# EAGLE design ModuloMaster (EAGLE 7.5.0)
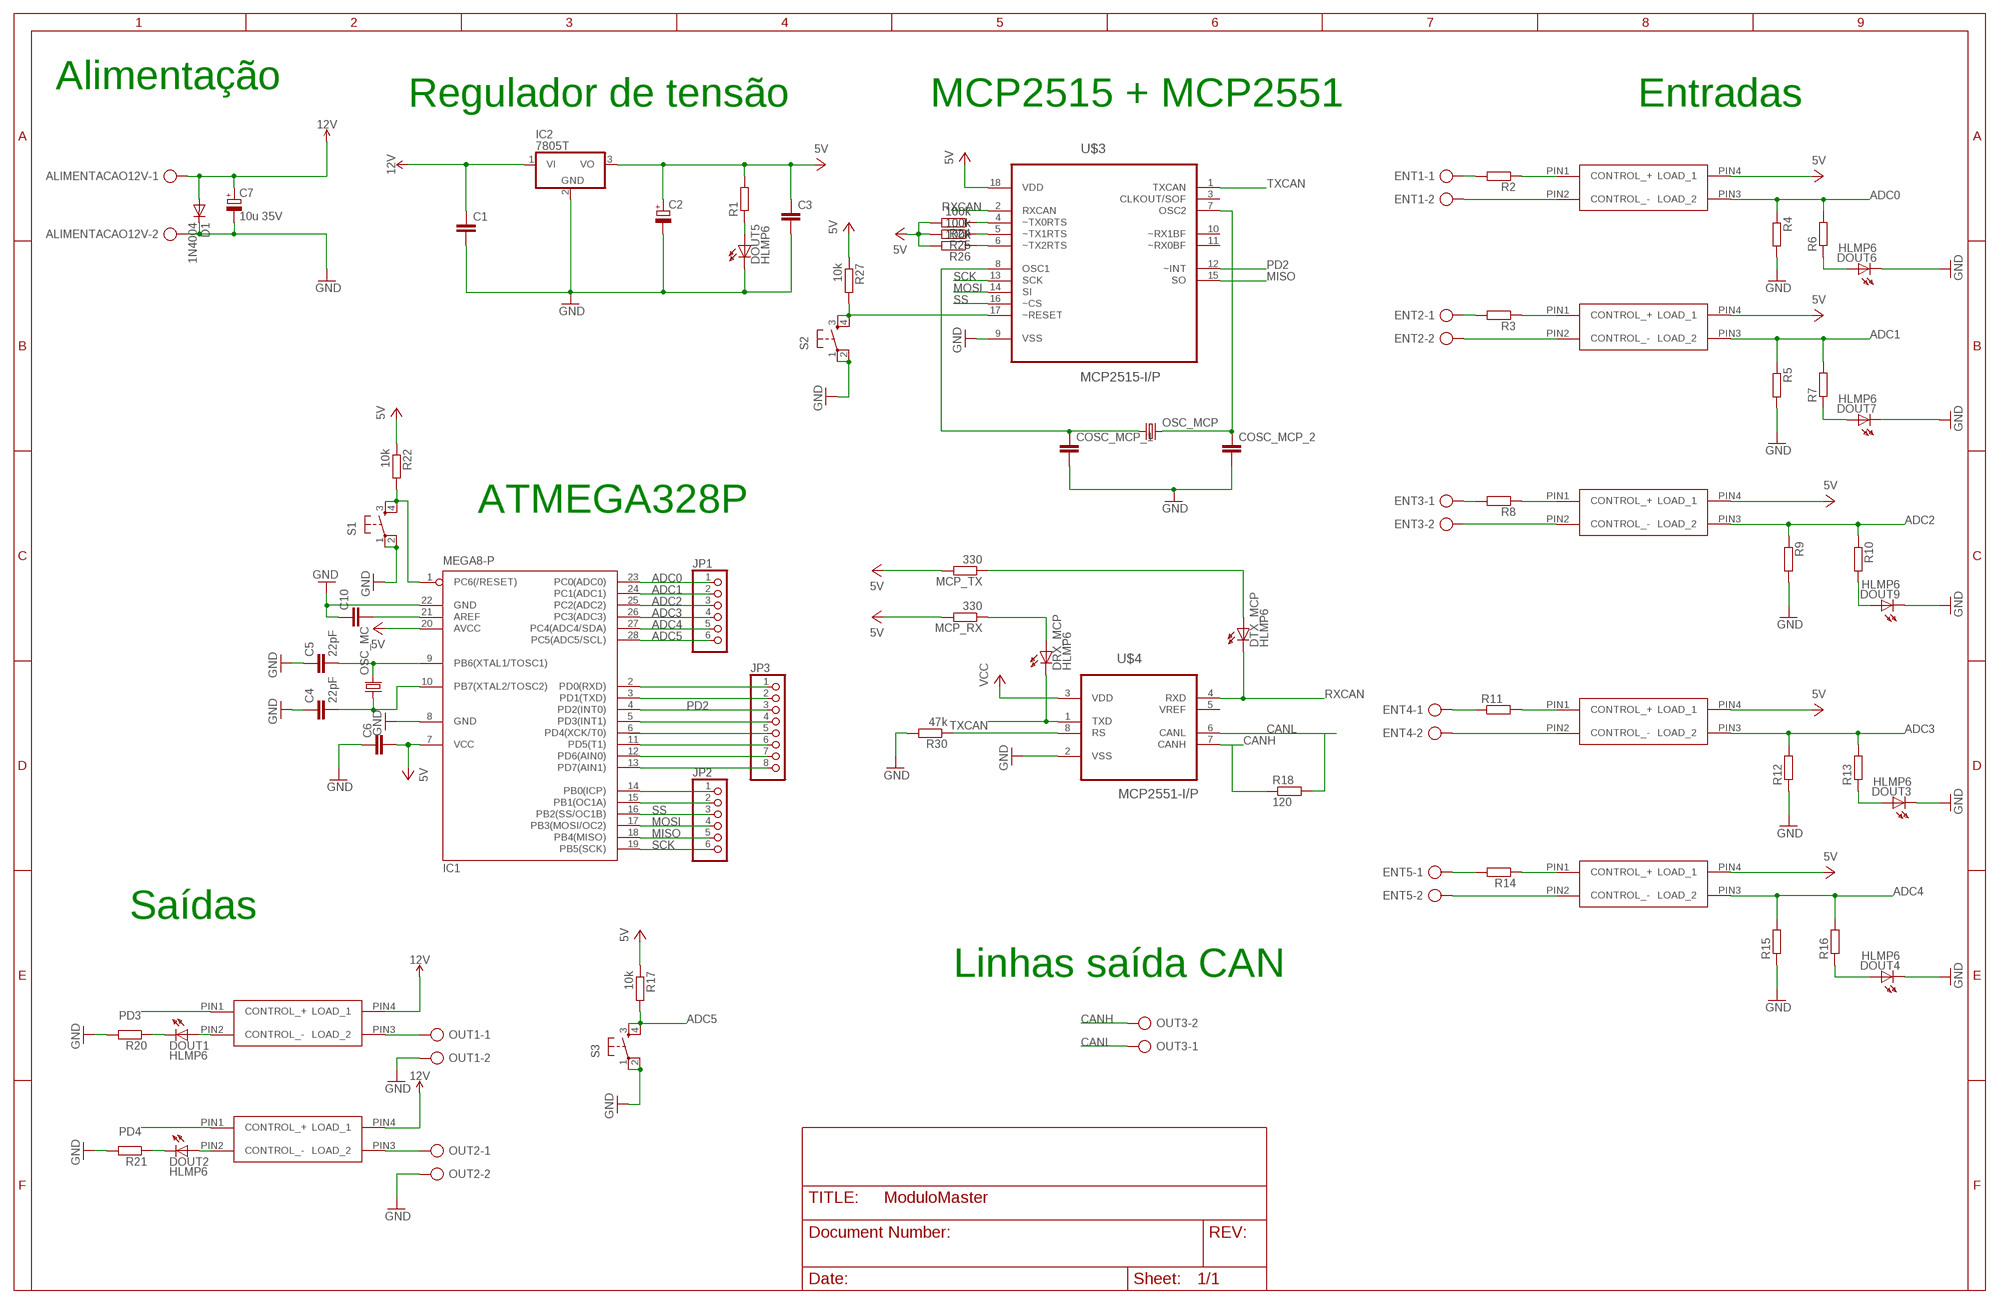
[diagram p0: schematic, sheet 1]

## Parts
ALIMENTACAO12V  AK300/2  [AK300/2]
C1  C-EU025-025X050  [C025-025X050]
C2  CPOL-EUSANYO_C6  [SANYO-OSCON_C6]
C3  C-EU025-025X050  [C025-025X050]
C4  22pF  CAP_  [AXIAL-5MM]
C5  22pF  CAP_  [AXIAL-5MM]
C6  CAP_  [AXIAL-5MM]
C7  10u 35V  CPOL-EUSANYO_C6  [SANYO-OSCON_C6]
C10  CAP_  [AXIAL-5MM]
COSC_MCP_1  CAP_  [AXIAL-5MM]
COSC_MCP_2  CAP_  [AXIAL-5MM]
D1  1N4004  [DO41-10]
DOUT1  HLMP6  [HLMP6]
DOUT2  HLMP6  [HLMP6]
DOUT3  HLMP6  [HLMP6]
DOUT4  HLMP6  [HLMP6]
DOUT5  HLMP6  [HLMP6]
DOUT6  HLMP6  [HLMP6]
DOUT7  HLMP6  [HLMP6]
DOUT9  HLMP6  [HLMP6]
DRX_MCP  HLMP6  [HLMP6]
DTX_MCP  HLMP6  [HLMP6]
ENT1  AK300/2  [AK300/2]
ENT2  AK300/2  [AK300/2]
ENT3  AK300/2  [AK300/2]
ENT4  AK300/2  [AK300/2]
ENT5  AK300/2  [AK300/2]
IC1  MEGA8-P  [DIL28-3]
IC2  7805T  [TO220H]
JP1  PINHD-1X6  [1X06]
JP2  PINHD-1X6  [1X06]
JP3  PINHD-1X8  [1X08]
MCP_RX  330  R-EU_0204/7  [0204/7]
MCP_TX  330  R-EU_0204/7  [0204/7]
OSC_MC  CRYSTALHC49S  [HC49/S]
OSC_MCP  CRYSTALHC49S  [HC49/S]
OUT1  AK300/2  [AK300/2]
OUT2  AK300/2  [AK300/2]
OUT3  AK300/2  [AK300/2]
R1  R-EU_0204/7  [0204/7]
R2  R-EU_0204/7  [0204/7]
R3  R-EU_0204/7  [0204/7]
R4  R-EU_0204/7  [0204/7]
R5  R-EU_0204/7  [0204/7]
R6  R-EU_0204/7  [0204/7]
R7  R-EU_0204/7  [0204/7]
R8  R-EU_0204/7  [0204/7]
R9  R-EU_0204/7  [0204/7]
R10  R-EU_0204/7  [0204/7]
R11  R-EU_0204/7  [0204/7]
R12  R-EU_0204/7  [0204/7]
R13  R-EU_0204/7  [0204/7]
R14  R-EU_0204/7  [0204/7]
R15  R-EU_0204/7  [0204/7]
R16  R-EU_0204/7  [0204/7]
R17  10k  R-EU_0204/7  [0204/7]
R18  120  R-EU_0204/7  [0204/7]
R20  R-EU_0204/7  [0204/7]
R21  R-EU_0204/7  [0204/7]
R22  10k  R-EU_0204/7  [0204/7]
R24  100k  R-EU_0204/7  [0204/7]
R25  100k  R-EU_0204/7  [0204/7]
R26  100k  R-EU_0204/7  [0204/7]
R27  10k  R-EU_0204/7  [0204/7]
R30  47k  R-EU_0204/7  [0204/7]
S1  TAC_SWITCHPTH  [TACTILE-PTH]
S2  TAC_SWITCHPTH  [TACTILE-PTH]
S3  TAC_SWITCHPTH  [TACTILE-PTH]
U$1  OPTO-RELAY-CPC1017N  [SOP-4]
U$2  OPTO-RELAY-CPC1017N  [SOP-4]
U$3  MCP2515-I/P  [DIP254P762X432-18]
U$4  MCP2551-I/P  [DIP254P762X432-8]
U$5  OPTO-RELAY-CPC1017N  [SOP-4]
U$6  OPTO-RELAY-CPC1017N  [SOP-4]
U$7  OPTO-RELAY-CPC1017N  [SOP-4]
U$8  OPTO-RELAY-CPC1017N  [SOP-4]
U$9  OPTO-RELAY-CPC1017N  [SOP-4]

## Nets
5V: C2.+ C3.1 IC2.3(VO) R1.2
ADC0: IC1.23(PC0(ADC0)) JP1.1 R4.1 R6.2 U$5.PIN3(LOAD_2)
ADC1: IC1.24(PC1(ADC1)) JP1.2 R5.1 R7.2 U$6.PIN3(LOAD_2)
ADC2: IC1.25(PC2(ADC2)) JP1.3 R9.1 R10.1 U$7.PIN3(LOAD_2)
ADC3: IC1.26(PC3(ADC3)) JP1.4 R12.2 R13.2 U$8.PIN3(LOAD_2)
ADC4: IC1.27(PC4(ADC4/SDA)) JP1.5 R15.2 R16.2 U$9.PIN3(LOAD_2)
ADC5: IC1.28(PC5(ADC5/SCL)) JP1.6 R17.2 S3.3 S3.4
CANH: OUT3.2 R18.1 U$4.7(CANH)
CANL: OUT3.1 R18.2 U$4.6(CANL)
GND: ALIMENTACAO12V.2 C1.2 C2.- C3.2 C4.P$1 C5.P$1 C6.P$1 C7.- C10.P$1 COSC_MCP_1.P$2 COSC_MCP_2.P$2 D1.C DOUT3.K DOUT4.K DOUT5.K DOUT6.K DOUT7.K DOUT9.K IC1.8(GND) IC1.22(GND) IC2.2(GND) OUT1.2 OUT2.2 R4.2 R5.2 R9.2 R12.1 R15.1 R20.2 R21.2 R30.2 S1.1 S1.2 S2.1 S2.2 S3.1 S3.2 U$3.9(VSS) U$4.2(VSS)
MISO: IC1.18(PB4(MISO)) JP2.5 U$3.15(SO)
MOSI: IC1.17(PB3(MOSI/OC2)) JP2.4 U$3.14(SI)
N$1: DOUT2.A U$2.PIN2(CONTROL_-)
N$2: DOUT1.A U$1.PIN2(CONTROL_-)
N$3: C4.P$2 IC1.10(PB7(XTAL2/TOSC2)) OSC_MC.1
N$4: C5.P$2 IC1.9(PB6(XTAL1/TOSC1)) OSC_MC.2
N$5: ENT4.1 R11.1
N$6: DRX_MCP.A MCP_RX.1
N$7: DTX_MCP.A MCP_TX.1
N$8: R11.2 U$8.PIN1(CONTROL_+)
N$9: C10.P$2 IC1.21(AREF)
N$10: ENT1.1 R2.2
N$11: R2.1 U$5.PIN1(CONTROL_+)
N$12: ENT4.2 U$8.PIN2(CONTROL_-)
N$13: COSC_MCP_1.P$1 OSC_MCP.1 U$3.8(OSC1)
N$14: COSC_MCP_2.P$1 OSC_MCP.2 U$3.7(OSC2)
N$15: ENT5.1 R14.2
N$16: R14.1 U$9.PIN1(CONTROL_+)
N$17: ENT5.2 U$9.PIN2(CONTROL_-)
N$20: ENT1.2 U$5.PIN2(CONTROL_-)
N$21: ENT2.1 R3.2
N$22: OUT1.1 U$1.PIN3(LOAD_2)
N$23: IC1.1(PC6(/RESET)) R22.2 S1.3 S1.4
N$25: DOUT1.K R20.1
N$26: OUT2.1 U$2.PIN3(LOAD_2)
N$27: DOUT2.K R21.1
N$28: R30.1 U$4.8(RS)
N$29: R25.1 U$3.5(~TX1RTS)
N$30: R24.1 U$3.4(~TX0RTS)
N$31: R26.1 U$3.6(~TX2RTS)
N$32: ENT2.2 U$6.PIN2(CONTROL_-)
N$33: R3.1 U$6.PIN1(CONTROL_+)
N$34: DOUT5.A R1.1
N$35: DOUT6.A R6.1
N$36: DOUT7.A R7.1
N$37: R27.2 S2.3 S2.4 U$3.17(~RESET)
N$39: DOUT3.A R13.1
N$40: ENT3.1 R8.2
N$41: R8.1 U$7.PIN1(CONTROL_+)
N$42: ENT3.2 U$7.PIN2(CONTROL_-)
N$45: DOUT9.A R10.2
N$48: DOUT4.A R16.1
N$56: IC1.14(PB0(ICP)) JP2.1
N$57: IC1.15(PB1(OC1A)) JP2.2
N$62: IC1.2(PD0(RXD)) JP3.1
N$63: IC1.3(PD1(TXD)) JP3.2
N$64: IC1.13(PD7(AIN1)) JP3.8
N$65: IC1.12(PD6(AIN0)) JP3.7
N$66: IC1.11(PD5(T1)) JP3.6
PD2: IC1.4(PD2(INT0)) JP3.3 U$3.12(~INT)
PD3: IC1.5(PD3(INT1)) JP3.4 U$1.PIN1(CONTROL_+)
PD4: IC1.6(PD4(XCK/T0)) JP3.5 U$2.PIN1(CONTROL_+)
RXCAN: DTX_MCP.K U$3.2(RXCAN) U$4.4(RXD)
SCK: IC1.19(PB5(SCK)) JP2.6 U$3.13(SCK)
SS: IC1.16(PB2(SS/OC1B)) JP2.3 U$3.16(~CS)
TXCAN: DRX_MCP.K U$3.1(TXCAN) U$4.1(TXD)
VCC: C6.P$2 IC1.7(VCC) IC1.20(AVCC) MCP_RX.2 MCP_TX.2 R17.1 R22.1 R24.2 R25.2 R26.2 R27.1 U$3.18(VDD) U$4.3(VDD) U$5.PIN4(LOAD_1) U$6.PIN4(LOAD_1) U$7.PIN4(LOAD_1) U$8.PIN4(LOAD_1) U$9.PIN4(LOAD_1) ; supply symbol labelled 5V
VDD: ALIMENTACAO12V.1 C1.1 C7.+ D1.A IC2.1(VI) U$1.PIN4(LOAD_1) U$2.PIN4(LOAD_1) ; supply symbol labelled 12V
Unconnected: U$3.3(CLKOUT/SOF) U$3.10(~RX1BF) U$3.11(~RX0BF) U$4.5(VREF)

## Notes on the sheet
- Alimentação
- Regulador de tensão | MCP2515 + MCP2551 | Entradas
- ATMEGA328P
- Saídas
- Linhas saída CAN

## Library data of the parts
ALIMENTACAO12V ENT1-ENT5 OUT1-OUT3 = con-ptr500:AK300/2: CONNECTOR; OC_FARNELL: unknown; OC_NEWARK: unknown
C1 C3 = rcl:C-EU: CAPACITOR, European symbol
C2 C7 = rcl:CPOL-EU: POLARIZED CAPACITOR, European symbol
C4-C6 C10 COSC_MCP_1 COSC_MCP_2 = SparkFun-Passives:CAP: Capacitor Standard 0603 ceramic capacitor, and 0.1" leaded capacitor.
D1 = diode:1N4004: DIODE general purpose rectifier, 1 A
DOUT1-DOUT7 DOUT9 DRX_MCP DTX_MCP = display-hp:HLMP6: LED 2mm horizontal; MF: AGILENT TECHNOLOGIES; MPN: HLMP-6500; OC_FARNELL: 1652490; OC_NEWARK: 40K0088
IC1 = atmel:MEGA8-P: MICROCONTROLLER 8 Kbytes FLASH, 1 kbytes SRAM, 512 bytes EEPROM, USART, 4-channel 10 bit ADC, 2-channel 8 bit ADC Pin compatible with Atmega48, ATMega88, ATMega168 Source: avr.lbr; OC_FARNELL: unknown; OC_NEWARK: unknown
IC2 = linear:78*: Positive VOLTAGE REGULATOR Source: http://cache.national.com/ds/LM/LM78L05.pdf http://www.fairchildsemi.com/ds/LM/LM7805.pdf
JP1 JP2 = pinhead:PINHD-1X6: PIN HEADER
JP3 = pinhead:PINHD-1X8: PIN HEADER
MCP_RX MCP_TX R1-R18 R20-R22 R24-R27 R30 = resistor:R-EU_: RESISTOR, European symbol
OSC_MC OSC_MCP = crystal:CRYSTAL: CRYSTAL; OC_FARNELL: 1667008; OC_NEWARK: unknown
S1-S3 = SparkFun-Retired:TAC_SWITCH: Momentary Switch Button commonly used for reset or general input. Spark Fun Electronics SKU : COM-00097 SMT- SWCH-08247
U$1 U$2 U$5-U$9 = Feesta-parts:OPTO-RELAY-CPC1017N
U$3 = Microchip_By_element14_Batch_1:MCP2515-I/P: Stand-Alone CAN Controller; DESCRIPTION: CAN CONTRL; MPN: MCP2515-I/P; OC_FARNELL: 1439391; OC_NEWARK: 61K2945; PACKAGE: PDIP-18; SUPPLIER: MICROCHIP
U$4 = Microchip_By_element14_Batch_1:MCP2551-I/P: High-Speed CAN Transceiver; DESCRIPTION: CAN CTRL; MPN: MCP2551-I/P; OC_FARNELL: 1292240; OC_NEWARK: 61K2947; PACKAGE: PDIP-8; SUPPLIER: Microchip

## Board
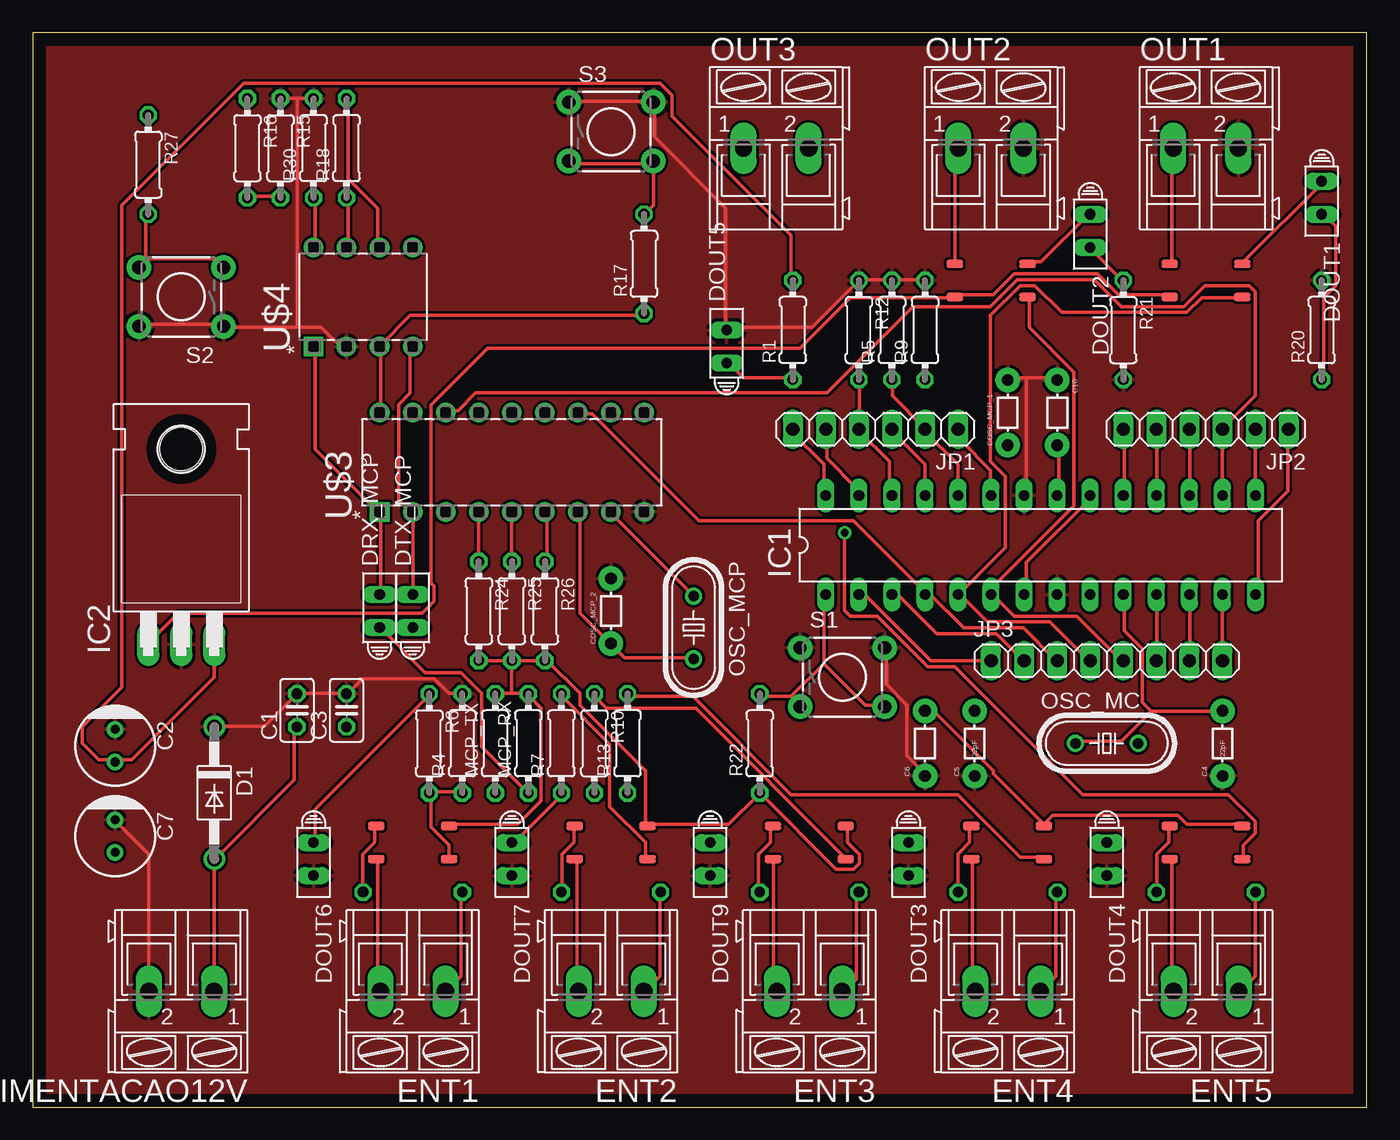
[diagram p1: board, top side]
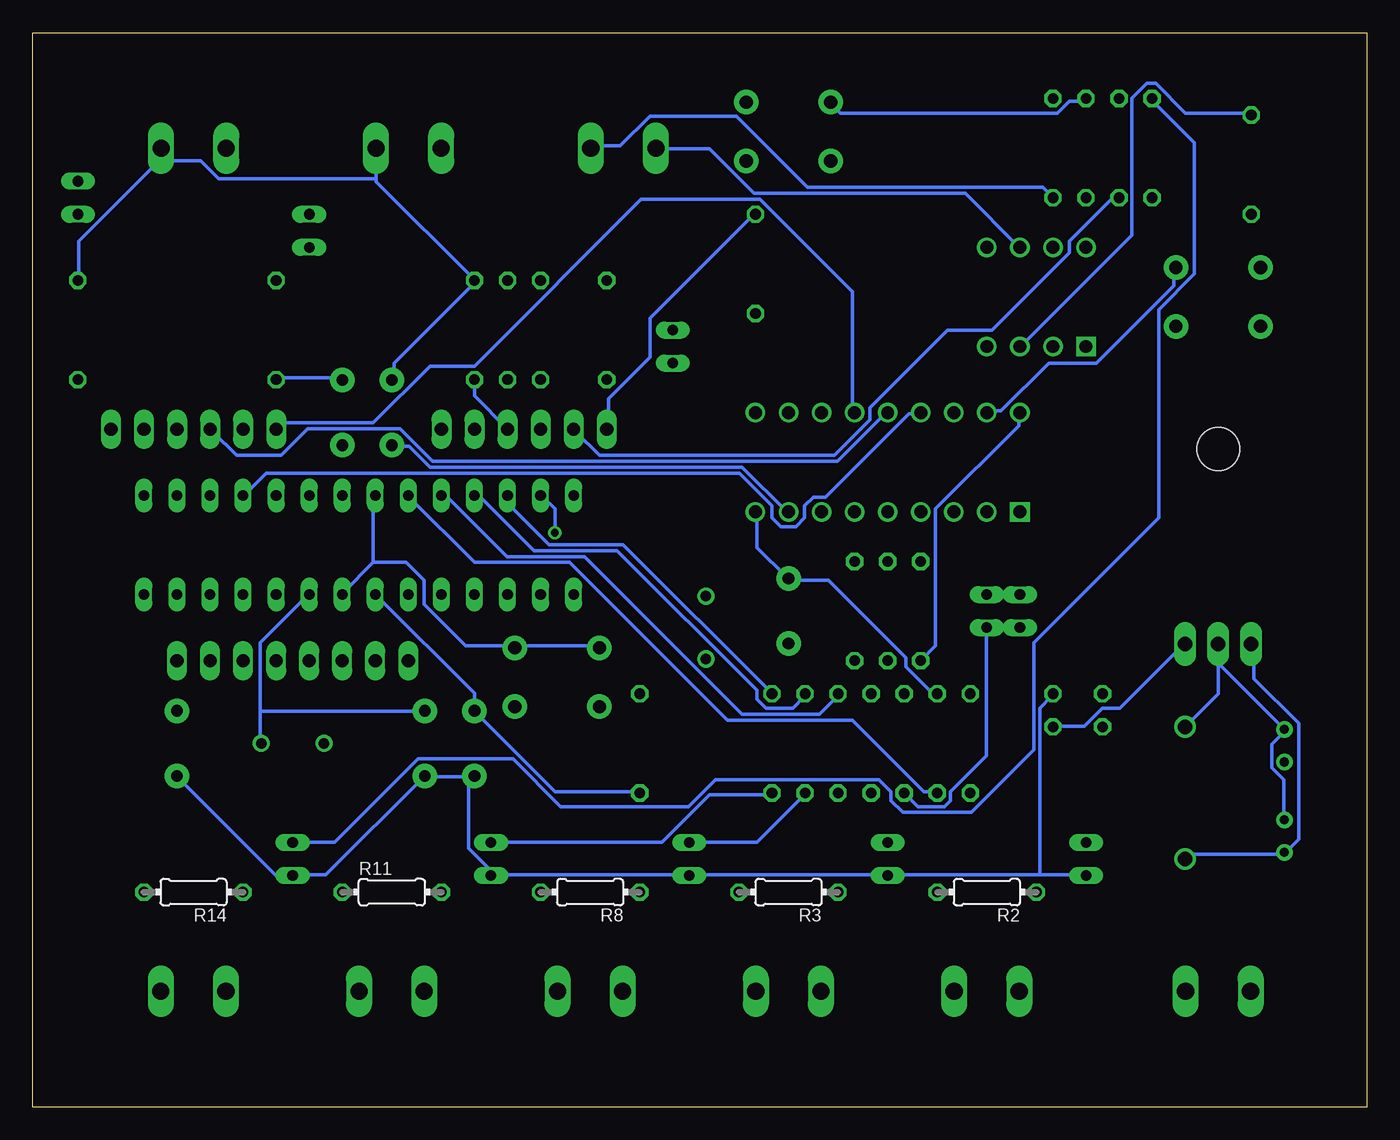
[diagram p2: board, bottom side, seen from below]

Size 102.54 x 82.54 mm. Coordinates in mm from the lower left corner, seen from the top.
Outline: 0,0 102.54,0 102.54,82.54 0,82.54 0,0
Copper layers (1*16): Top 0.035mm / dielectric 1.5mm / Bottom 0.035mm
Design rules "default": minimum track width 10mil, minimum drill 24mil, track to track 8mil, track to pad 8mil, pad to pad 8mil, via to via 8mil, smd to smd 8mil, copper to edge 40mil, drill to drill 8mil, minimum pad ring 10mil, minimum via ring 8mil, stop-mask expansion 4mil, vias tented up to drill 0mil, thermal gap 10mil

### Footprints (pad centres in the part's own frame; a part is rotated, then mirrored left to right if it is on the bottom)
AK300/2 = drill 1.321 long: 1 -2.515,0; 2 2.489,0
C025-025X050 = drill 0.813 octagon: 1 -1.27,0; 2 1.27,0
SANYO-OSCON_C6 = drill 0.7 pad 1.27: + 1.25,0; - -1.25,0
AXIAL-5MM = drill 0.9 pad 1.88: P$1 -2.5,0; P$2 2.5,0
DO41-10 = drill 1.118: A 5.08,0; C -5.08,0
HLMP6 = drill 0.813 long: A -1.27,0; K 1.27,0
DIL28-3 = drill 0.813 long: 1 -16.51,-3.81; 2 -13.97,-3.81; 3 -11.43,-3.81; 4 -8.89,-3.81; 5 -6.35,-3.81; 6 -3.81,-3.81; 7 -1.27,-3.81; 8 1.27,-3.81; 9 3.81,-3.81; 10 6.35,-3.81; 11 8.89,-3.81; 12 11.43,-3.81; 13 13.97,-3.81; 14 16.51,-3.81; 15 16.51,3.81; 16 13.97,3.81; 17 11.43,3.81; 18 8.89,3.81; 19 6.35,3.81; 20 3.81,3.81; 21 1.27,3.81; 22 -1.27,3.81; 23 -3.81,3.81; 24 -6.35,3.81; 25 -8.89,3.81; 26 -11.43,3.81; 27 -13.97,3.81; 28 -16.51,3.81
TO220H = drill 1.118 long: 1 -2.54,-10.16; 2 0,-10.16; 3 2.54,-10.16 | hole 3.302: 0,4.826
1X06 = drill 1.016 long: 1 -6.35,0; 2 -3.81,0; 3 -1.27,0; 4 1.27,0; 5 3.81,0; 6 6.35,0
1X08 = drill 1.016 long: 1 -8.89,0; 2 -6.35,0; 3 -3.81,0; 4 -1.27,0; 5 1.27,0; 6 3.81,0; 7 6.35,0; 8 8.89,0
0204/7 = drill 0.813 octagon: 1 -3.81,0; 2 3.81,0
HC49/S = drill 0.813: 1 -2.413,0; 2 2.413,0
TACTILE-PTH = drill 1.016 pad 1.88: 1 -3.251,2.261; 2 3.251,2.261; 3 -3.251,-2.261; 4 3.251,-2.261
SOP-4 = smd 0.635 x 1.27: PIN1 -1.27,-2.794; PIN2 1.27,-2.794; PIN3 1.27,2.794; PIN4 -1.27,2.794
DIP254P762X432-18 = drill 0.991 square: 1 -7.62,20.32 | drill 0.991: 2 -7.62,17.78; 3 -7.62,15.24; 4 -7.62,12.7; 5 -7.62,10.16; 6 -7.62,7.62; 7 -7.62,5.08; 8 -7.62,2.54; 9 -7.62,0; 10 0,0; 11 0,2.54; 12 0,5.08; 13 0,7.62; 14 0,10.16; 15 0,12.7; 16 0,15.24; 17 0,17.78; 18 0,20.32
DIP254P762X432-8 = drill 0.991 square: 1 -7.62,7.62 | drill 0.991: 2 -7.62,5.08; 3 -7.62,2.54; 4 -7.62,0; 5 0,0; 6 0,2.54; 7 0,5.08; 8 0,7.62

### Placement (x,y rotation side)
ALIMENTACAO12V  11.43,8.89 180 top
C1  20.32,30.48 90 top
C2  6.35,27.76 270 top
C3  24.13,30.48 90 top
C4  91.44,27.94 90 top
C5  72.39,27.94 90 top
C6  68.58,27.94 90 top
C7  6.35,20.81 270 top
C10  78.74,53.34 270 top
COSC_MCP_1  74.93,53.34 90 top
COSC_MCP_2  44.45,38.1 90 top
D1  13.97,24.13 270 top
DOUT1  99.06,69.85 270 top
DOUT2  81.28,67.31 270 top
DOUT3  67.31,19.05 270 top
DOUT4  82.55,19.05 270 top
DOUT5  53.34,58.42 90 top
DOUT6  21.59,19.05 270 top
DOUT7  36.83,19.05 270 top
DOUT9  52.07,19.05 270 top
DRX_MCP  26.67,38.1 90 top
DTX_MCP  29.21,38.1 90 top
ENT1  29.21,8.89 180 top
ENT2  44.45,8.89 180 top
ENT3  59.69,8.89 180 top
ENT4  74.93,8.89 180 top
ENT5  90.17,8.89 180 top
IC1  77.47,43.18 0 top
IC2  11.43,45.72 0 top
JP1  64.77,52.07 180 top
JP2  90.17,52.07 180 top
JP3  82.55,34.29 0 top
MCP_RX  38.1,27.94 90 top
MCP_TX  35.56,27.94 90 top
OSC_MC  82.55,27.94 0 top
OSC_MCP  50.8,36.83 270 top
OUT1  90.17,73.66 0 top
OUT2  73.66,73.66 0 top
OUT3  57.15,73.66 0 top
R1  58.42,59.69 90 top
R2  29.21,16.51 180 bottom
R3  44.45,16.51 180 bottom
R4  33.02,27.94 90 top
R5  66.04,59.69 90 top
R6  30.48,27.94 270 top
R7  40.64,27.94 90 top
R8  59.69,16.51 180 bottom
R9  68.58,59.69 90 top
R10  43.18,27.94 270 top
R11  74.93,16.51 0 bottom
R12  63.5,59.69 270 top
R13  45.72,27.94 90 top
R14  90.17,16.51 180 bottom
R15  19.05,73.66 270 top
R16  16.51,73.66 270 top
R17  46.99,64.77 90 top
R18  24.13,73.66 90 top
R20  99.06,59.69 90 top
R21  83.82,59.69 270 top
R22  55.88,27.94 90 top
R24  34.29,38.1 270 top
R25  36.83,38.1 270 top
R26  39.37,38.1 270 top
R27  8.89,72.39 270 top
R30  21.59,73.66 90 top
S1  62.23,33.02 0 top
S2  11.43,62.23 180 top
S3  44.45,74.93 0 top
U$1  90.17,63.5 90 top
U$2  73.66,63.5 90 top
U$3  46.99,53.34 90 top
U$4  29.21,66.04 90 top
U$5  29.21,20.32 270 top
U$6  44.45,20.32 270 top
U$7  59.69,20.32 270 top
U$8  74.93,20.32 270 top
U$9  90.17,20.32 270 top

### Tracks (layer width: path | path; a pad name or v marks a point on that pad's centre or on a via)
5V
  Top 0.254: 6.4,26.52 C2.+ | 14.17,35.43 IC2.3 13.97,33.02 7.62,26.67 6.51,26.67 C2.+ | R1.2 58.29,63.55 58.29,66.98 49.15,76.12 49.15,77.72 48.23,78.64 16.23,78.64 6.86,69.27 6.86,32.26 3.81,29.21 3.81,27.94 5.08,26.67 6.19,26.67 C2.+
  Bottom 0.254: C3.1 24,29.26 21.72,29.26 20.34,30.63 18.97,30.63 14.17,35.43 IC2.3
ADC0
  Top 0.254: U$5.PIN3 32,20.12 30.63,21.49 30.63,24 R6.2 30.63,24.23 32.92,24.23 R4.1 | IC1.23 73.61,47.09 73.61,48.92 71.32,51.21 71.32,51.89 JP1.1
  Bottom 0.254: R4.1 33.15,24.23 34.06,24.23 39.55,29.72 49.15,29.72 61.27,41.83 68.58,41.83 73.61,46.86 IC1.23
ADC1
  Top 0.254: IC1.24 71.09,47.09 71.09,49.38 68.58,51.89 JP1.2 68.58,52.12 66.06,54.63 66.06,55.78 R5.1 | U$6.PIN3 47.09,19.2 47.09,20.34 44.35,23.09 44.35,27.89 40.69,31.55 R7.2
  Bottom 0.254: IC1.24 71.09,46.86 70.64,46.86 66.06,42.29 60.12,42.29 48.01,30.18 42.06,30.18 40.69,31.55 R7.2
ADC2
  Top 0.254: IC1.25 68.58,49.38 66.06,51.89 JP1.3 | U$7.PIN3 62.41,19.2 50.98,30.63 44.12,30.63 43.2,31.55 R10.1
  Bottom 0.254: R9.1 68.58,54.63 66.06,52.12 JP1.3 | IC1.25 68.58,46.86 68.12,46.86 64.01,42.75 57.61,42.75 46.86,32 46.86,31.32 46.18,30.63 44.12,30.63 43.2,31.55 R10.1
ADC3
  Top 0.254: IC1.26 65.84,47.09 65.84,49.61 63.55,51.89 JP1.4 63.55,52.12 63.55,55.78 R12.2 | U$8.PIN3 77.72,19.2 75.89,19.2 71.09,24 58.29,24 50.75,31.55 45.72,31.55 R13.2
  Bottom 0.254: IC1.26 65.84,46.86 65.84,46.18 62.87,43.2 57.15,43.2 45.72,31.77 R13.2
ADC4  (via drill 0.61)
  Top 0.254: R16.2 16.69,69.95 18.97,69.95 R15.2 | v62.41,44.12 62.41,38.18 62.87,37.72 64.92,37.72 68.81,33.83 70.87,33.83 80.7,24 91.9,24 93.95,21.95 93.95,21.03 93.04,20.12 93.04,19.2 U$9.PIN3 | JP1.5 61.04,51.89 61.04,49.84 63.32,47.55 63.32,47.09 IC1.27
  Bottom 0.254: v62.41,44.12 62.41,45.95 63.32,46.86 IC1.27 | R15.2 19.2,69.72 19.66,69.72 22.86,66.52 22.86,65.61 28.8,59.66 32.23,59.66 38.18,53.72 38.18,52.81 40.92,50.06 58.98,50.06 60.81,51.89 JP1.5
ADC5
  Top 0.254: IC1.28 60.81,47.09 60.81,49.38 58.29,51.89 JP1.6 | 47.09,68.58 R17.2 47.7,69.29 S3.4 47.5,72.47 41.38,72.47 S3.3
  Bottom 0.254: JP1.6 58.29,52.12 58.29,54.41 55.09,57.61 55.09,60.58 47.09,68.58 R17.2
CANH
  Top 0.254: R18.1 24.23,69.72 24.23,66.06 U$4.7
  Bottom 0.254: R18.1 24.92,70.64 42.98,70.64 48.46,76.12 55.09,76.12 57.38,73.84 59.44,73.84 OUT3.2
CANL
  Top 0.254: R18.2 24.23,77.27 24.23,71.32 26.52,69.04 26.52,66.06 U$4.6
  Bottom 0.254: OUT3.1 54.63,73.61 50.52,73.61 47.09,70.18 30.86,70.18 26.75,66.06 U$4.6
GND
  Top 0.254: S1.2 65.61,35.2 65.61,32.46 67.21,30.86 67.21,26.98 68.58,25.6 C6.P$1 | ALIMENTACAO12V.2 8.91,8.91 8.91,19.43 6.4,21.95 C7.- | R4.2 32.92,31.77 32,31.77 30.86,32.92 25.38,32.92 24.23,31.77 C3.2 24,31.77 20.34,31.77 C1.2 17.83,29.26 14.17,29.26 D1.C | 20.34,77.5 21.49,77.5 R30.2 | 20.34,77.5 19.2,77.5 R15.1 | 20.34,59.89 14.86,59.89 S2.1 14.63,60.12 8.23,60.12 S2.2 | 20.34,59.89 22.17,59.89 23.55,58.52 24,58.52 U$4.2 | 20.34,59.89 20.34,77.5 | 76.35,56.01 78.64,56.01 C10.P$1 | 76.35,56.01 74.98,56.01 COSC_MCP_1.P$2 | 76.35,56.01 76.35,47.09 IC1.22 | S3.1 41.38,77.27 47.55,77.27 S3.2 47.78,77.04 47.78,74.52 53.26,69.04 53.26,59.89 DOUT5.K 53.49,59.89 59.89,59.89 R12.1 63.55,63.55 65.84,63.55 R5.2 66.06,63.55 68.58,63.55 R9.2
  Bottom 0.254: C4.P$1 91.44,25.38 83.9,17.83 82.75,17.83 DOUT4.K 82.53,17.83 80.01,17.83 72.47,25.38 C5.P$1 72.24,25.38 69.49,25.38 69.04,24.92 | S1.1 58.98,35.43 65.38,35.43 S1.2 65.61,35.43 69.27,35.43 72.47,38.63 72.47,40.46 73.84,41.83 76.35,41.83 | 69.04,24.92 69.04,19.89 67.44,18.29 67.44,17.83 DOUT3.K 67.21,17.83 52.12,17.83 DOUT9.K 51.89,17.83 37.03,17.83 DOUT7.K 36.8,17.83 25.15,17.83 | 69.04,24.92 68.58,25.38 C6.P$1 69.04,24.92 | 25.15,17.83 21.72,17.83 DOUT6.K | C7.- 6.4,22.17 6.4,25.15 7.32,26.06 7.32,27.89 6.4,28.8 C2.- 11.43,34.09 | U$3.9 46.86,45.72 46.86,42.98 44.58,40.69 COSC_MCP_2.P$2 44.35,40.46 41.38,40.46 35.43,34.52 35.43,33.83 33.15,31.55 R4.2 | 13.95,29.26 D1.C 11.43,31.75 11.43,34.09 | 25.15,17.83 25.15,30.63 24.23,31.55 C3.2 | 76.35,41.83 76.35,46.86 IC1.22 | 76.35,41.83 78.64,39.55 IC1.8 | R21.2 83.67,56.01 78.87,56.01 C10.P$1 | 92.81,72.69 98.98,66.52 98.98,63.55 R20.2 | 92.81,72.69 92.81,73.61 OUT1.2 92.81,72.69 | 76.12,71.32 76.12,71.09 68.58,63.55 R9.2 68.58,63.32 74.75,57.15 74.75,56.01 COSC_MCP_1.P$2 | 76.12,71.32 76.12,73.61 OUT2.2 | 92.81,72.69 89.61,72.69 88.24,71.32 76.12,71.32 | R30.2 21.72,77.27 22.86,77.27 23.77,76.35 40.46,76.35 41.15,77.04 S3.1 | IC2.2 11.43,34.09
  pour Top: -1.27,86.36 107.95,86.36 107.95,-5.08 -8.89,-5.08 -8.89,86.36
MISO
  Top 0.254: IC1.18 86.41,47.09 86.41,51.89 JP2.5
  Bottom 0.254: U$3.15 34.29,53.26 35.2,53.26 41.6,46.86 42.52,46.86 43.2,46.18 43.2,45.26 43.89,44.58 45.03,44.58 45.72,45.26 45.72,46.18 48.23,48.69 84.58,48.69 86.18,47.09 IC1.18
MOSI
  Top 0.254: IC1.17 88.92,47.09 88.92,51.89 JP2.4
  Bottom 0.254: U$3.14 37.03,53.26 40.69,49.61 71.78,49.61 74.3,52.12 81.38,52.12 83.44,50.06 86.87,50.06 88.7,51.89 JP2.4
N$1
  Top 0.254: U$2.PIN2 76.58,64.92 77.5,64.92 81.15,68.58 DOUT2.A
N$2
  Top 0.254: U$1.PIN2 93.04,64.92 99.21,71.09 DOUT1.A
N$3
  Top 0.254: 85.95,30.4 83.67,28.12 80.24,28.12 OSC_MC.1 | 85.95,30.4 91.44,30.4 C4.P$2 | 85.95,30.4 85.27,31.09 85.27,35.2 83.9,36.58 83.9,39.32 IC1.10
N$4
  Bottom 0.254: 85.04,30.4 85.04,35.66 81.38,39.32 IC1.9 | 85.04,30.4 85.04,28.12 OSC_MC.2 | 85.04,30.4 72.47,30.4 C5.P$2
N$5
  Top 0.254: R11.1 78.64,16.46 78.64,10.06 77.5,8.91 ENT4.1
N$6
  Top 0.254: DRX_MCP.A 26.75,36.8 30.18,33.38 32.92,33.38 34.52,31.77 34.52,27.66 37.95,24.23 MCP_RX.1
N$7
  Bottom 0.254: MCP_TX.1 34.52,23.09 32.46,23.09 32,23.55 32,24.23 29.26,26.98 29.26,36.8 DTX_MCP.A
N$8
  Top 0.254: U$8.PIN1 72.01,21.49 72.01,20.34 71.09,19.43 71.09,16.69 R11.2
N$9
  Top 0.254: IC1.21 78.87,47.09 78.87,50.75 C10.P$2
N$10
  Top 0.254: R2.2 32.92,16.46 32.92,10.06 31.77,8.91 ENT1.1
N$11
  Top 0.254: U$5.PIN1 26.29,21.49 26.29,20.34 25.38,19.43 25.38,16.69 R2.1
N$12
  Top 0.254: U$8.PIN2 72.24,18.97 72.24,8.91 ENT4.2
N$13
  Top 0.254: OSC_MCP.1 50.75,39.32 44.35,45.72 U$3.8
  Bottom 0.254: COSC_MCP_1.P$1 74.75,50.75 73.61,50.75 72.01,49.15 48.01,49.15 44.58,45.72 U$3.8
N$14
  Top 0.254: OSC_MCP.2 50.75,34.52 45.49,34.52 44.58,35.43 COSC_MCP_2.P$1 44.35,35.66 42.06,37.95 42.06,45.72 U$3.7
N$15
  Top 0.254: R14.2 93.95,16.46 93.95,10.06 92.81,8.91 ENT5.1
N$16
  Top 0.254: U$9.PIN1 87.33,21.49 87.33,20.34 86.41,19.43 86.41,16.69 R14.1
N$17
  Top 0.254: U$9.PIN2 87.55,18.97 87.55,8.91 ENT5.2
N$20
  Top 0.254: U$5.PIN2 26.52,18.97 26.52,8.91 ENT1.2
N$21
  Top 0.254: R3.2 48.23,16.46 48.23,10.06 47.09,8.91 ENT2.1
N$22
  Top 0.254: U$1.PIN3 87.55,64.92 87.55,73.61 OUT1.1
N$23
  Top 0.254: 58.29,31.55 56.01,31.55 R22.2 | 58.29,31.55 58.98,30.86 S1.3 | 60.81,34.06 60.81,39.32 IC1.1 | 58.29,31.55 60.81,34.06 | 60.81,34.06 64.01,30.86 65.38,30.86 S1.4
N$25
  Top 0.254: R20.1 99.21,56.01 99.21,62.18 100.13,63.09 100.13,67.67 99.21,68.58 DOUT1.K
N$26
  Top 0.254: U$2.PIN3 70.87,73.38 OUT2.1
N$27
  Top 0.254: DOUT2.K 81.38,65.84 83.67,63.55 R21.1
N$28
  Top 0.254: R30.1 21.72,69.72 21.72,66.06 U$4.8
N$29
  Top 0.254: R25.1 36.8,42.06 36.8,45.72 U$3.5
N$30
  Top 0.254: U$3.4 R24.1
N$31
  Top 0.254: R26.1 39.55,42.06 39.55,45.72 U$3.6
N$32
  Top 0.254: U$6.PIN2 41.83,18.97 41.83,8.91 ENT2.2
N$33
  Top 0.254: U$6.PIN1 41.6,21.49 41.6,20.34 40.69,19.43 40.69,16.69 R3.1
N$34
  Top 0.254: R1.1 58.29,56.01 54.63,56.01 53.49,57.15 DOUT5.A
N$35
  Top 0.254: DOUT6.A 21.72,20.34 21.72,22.86 30.4,31.55 R6.1
N$36
  Top 0.254: DOUT7.A 37.03,20.34 40.69,24 R7.1
N$37
  Top 0.254: 8.69,65.15 8.69,68.58 R27.2 | 8.69,65.15 8.23,64.69 S2.4 8.69,65.15 | 8.69,65.15 14.17,65.15 14.63,64.69 S2.3
  Bottom 0.254: U$3.17 29.03,53.49 28.12,53.49 24.46,57.15 20.8,57.15 14.86,63.09 14.86,64.47 S2.3
N$39
  Bottom 0.254: DOUT3.A 67.21,20.34 54.18,20.34 50.52,24 45.72,24 R13.1
N$40
  Top 0.254: R8.2 63.32,16.46 63.32,9.83 62.41,8.91 ENT3.1
N$41
  Top 0.254: U$7.PIN1 56.69,21.49 56.69,20.34 55.78,19.43 55.78,16.69 R8.1
N$42
  Top 0.254: U$7.PIN2 56.92,18.97 56.92,9.14 57.15,8.91 ENT3.2
N$45
  Bottom 0.254: DOUT9.A 51.89,20.34 46.86,20.34 43.2,24 R10.2
N$48
  Bottom 0.254: DOUT4.A 82.53,20.34 79.32,20.34 72.92,26.75 65.61,26.75 61.95,23.09 52.12,23.09 50.06,25.15 37.49,25.15 36.58,24.23 36.58,23.55 35.66,22.63 30.4,22.63 25.6,27.43 25.6,35.66 16,45.26 16,61.27 13.26,64.01 13.26,74.07 16.46,77.27 R16.1
N$56
  Top 0.254: IC1.14 94.18,39.55 94.18,45.03 96.47,47.32 96.47,51.89 JP2.1
N$57
  Top 0.254: IC1.15 93.95,47.09 93.95,51.89 JP2.2
N$62
  Top 0.254: JP3.1 69.04,34.29 64.01,39.32 63.55,39.32 IC1.2
N$63
  Top 0.254: IC1.3 66.06,39.32 66.52,39.32 69.49,36.35 74.07,36.35 76.12,34.29 JP3.2
N$64
  Top 0.254: JP3.8 IC1.13
N$65
  Top 0.254: IC1.12 88.92,39.32 88.92,34.29 JP3.7
N$66
  Top 0.254: IC1.11 86.41,39.32 86.41,34.29 JP3.6
PD2
  Top 0.254: JP3.3 78.64,34.29 76.12,36.8 71.55,36.8 69.04,39.32 68.58,39.32 IC1.4 68.58,39.55 63.09,45.03 51.21,45.03 42.98,53.26 42.06,53.26 U$3.12
PD3
  Top 0.254: U$1.PIN1 92.81,62.18 89.84,62.18 88.7,61.04 79.1,61.04 77.04,63.09 75.89,63.09 73.61,60.81 73.61,49.61 74.75,48.46 74.75,42.98 71.32,39.55 IC1.5 71.32,39.32 73.38,37.26 78.18,37.26 81.15,34.29 JP3.4
PD4
  Top 0.254: U$2.PIN1 76.58,62.18 76.58,59.89 80.01,56.46 80.01,46.18 73.84,40.01 73.84,39.55 IC1.6 73.84,39.32 75.44,37.72 80.24,37.72 83.67,34.29 JP3.5
RXCAN
  Top 0.254: DTX_MCP.K 29.26,39.55 29.26,45.72 U$3.2 29.03,45.72 28.12,46.63 28.12,53.95 29.03,54.86 29.03,58.29 U$4.4
SCK
  Top 0.254: IC1.19 83.9,47.09 83.9,51.89 JP2.6
  Bottom 0.254: U$3.13 39.55,53.49 39.55,62.64 46.63,69.72 55.78,69.72 68.58,56.92 72.01,56.92 76.35,52.58 83.21,52.58 83.67,52.12 JP2.6
SS
  Top 0.254: IC1.16 JP2.3 91.44,52.12 93.95,54.63 93.95,62.64 93.5,63.09 90.07,63.09 88.47,61.49 83.67,61.49 81.61,63.55 75.67,63.55 73.61,61.49 67.67,61.49 61.04,54.86 34.06,54.86 32.69,53.49 31.77,53.49 U$3.16
TXCAN
  Top 0.254: DRX_MCP.K 26.75,39.55 26.75,45.72 U$3.1 26.52,45.72 21.72,50.52 21.72,58.29 U$4.1
VCC
  Top 0.254: R17.1 46.86,60.81 29.03,60.81 26.75,58.52 U$4.3 26.75,58.29 26.75,53.49 U$3.18 | 36.8,34.29 R24.2 | U$5.PIN4 32,21.72 37.26,21.72 39.09,23.55 39.09,30.63 38.18,31.55 MCP_RX.2 37.95,31.77 36.8,31.77 | 36.8,31.77 35.66,31.77 MCP_TX.2 | 36.8,31.77 36.8,34.29 | 36.8,34.29 R25.2 R26.2 39.55,34.29 42.06,31.77 42.06,30.86 47.09,25.83 47.09,21.72 U$6.PIN4 47.32,21.72 53.49,21.72 55.78,24 R22.1 61.72,18.29 63.09,18.29 63.55,18.75 63.55,19.43 62.64,20.34 62.64,21.49 U$7.PIN4 | IC1.7 76.35,39.55 76.35,41.83 81.38,46.86 IC1.20 | 77.72,21.72 73.84,25.6 73.84,25.83 69.27,30.4 68.58,30.4 C6.P$2 | 77.72,21.72 78.41,22.4 88.01,22.4 88.7,21.72 92.81,21.72 U$9.PIN4 | 77.72,21.72 U$8.PIN4
  Bottom 0.254: R27.1 8.91,76.35 13.95,76.35 16.23,78.64 16.92,78.64 18.06,77.5 18.06,66.98 26.52,58.52 U$4.3 | IC1.7 76.12,39.32 68.58,31.77 C6.P$2 68.58,30.4 62.41,24.23 56.01,24.23 R22.1 | R24.2 33.15,35.43 33.15,45.95 26.75,52.35 26.75,53.26 U$3.18
VDD
  Top 0.254: U$1.PIN4 87.33,62.41 83.44,62.41 81.84,64.01 75.44,64.01 73.84,62.41 70.87,62.41 U$2.PIN4 70.87,62.18 62.87,62.18 58.98,58.29 34.98,58.29 30.63,53.95 30.63,40.23 30.86,40.01 30.86,38.86 29.95,37.95 11.2,37.95 8.91,35.66 IC2.1 | C1.1 20.12,29.03 20.12,25.15 14.17,19.2 D1.A 13.95,18.97 ALIMENTACAO12V.1
  Bottom 0.254: D1.A 13.95,19.2 13.72,19.43 6.4,19.43 C7.+ 6.17,19.66 5.26,20.57 5.26,29.49 8.69,32.92 8.69,35.43 IC2.1